# EAGLE design BME280-Breakout_v10 (EAGLE 7.5.0)
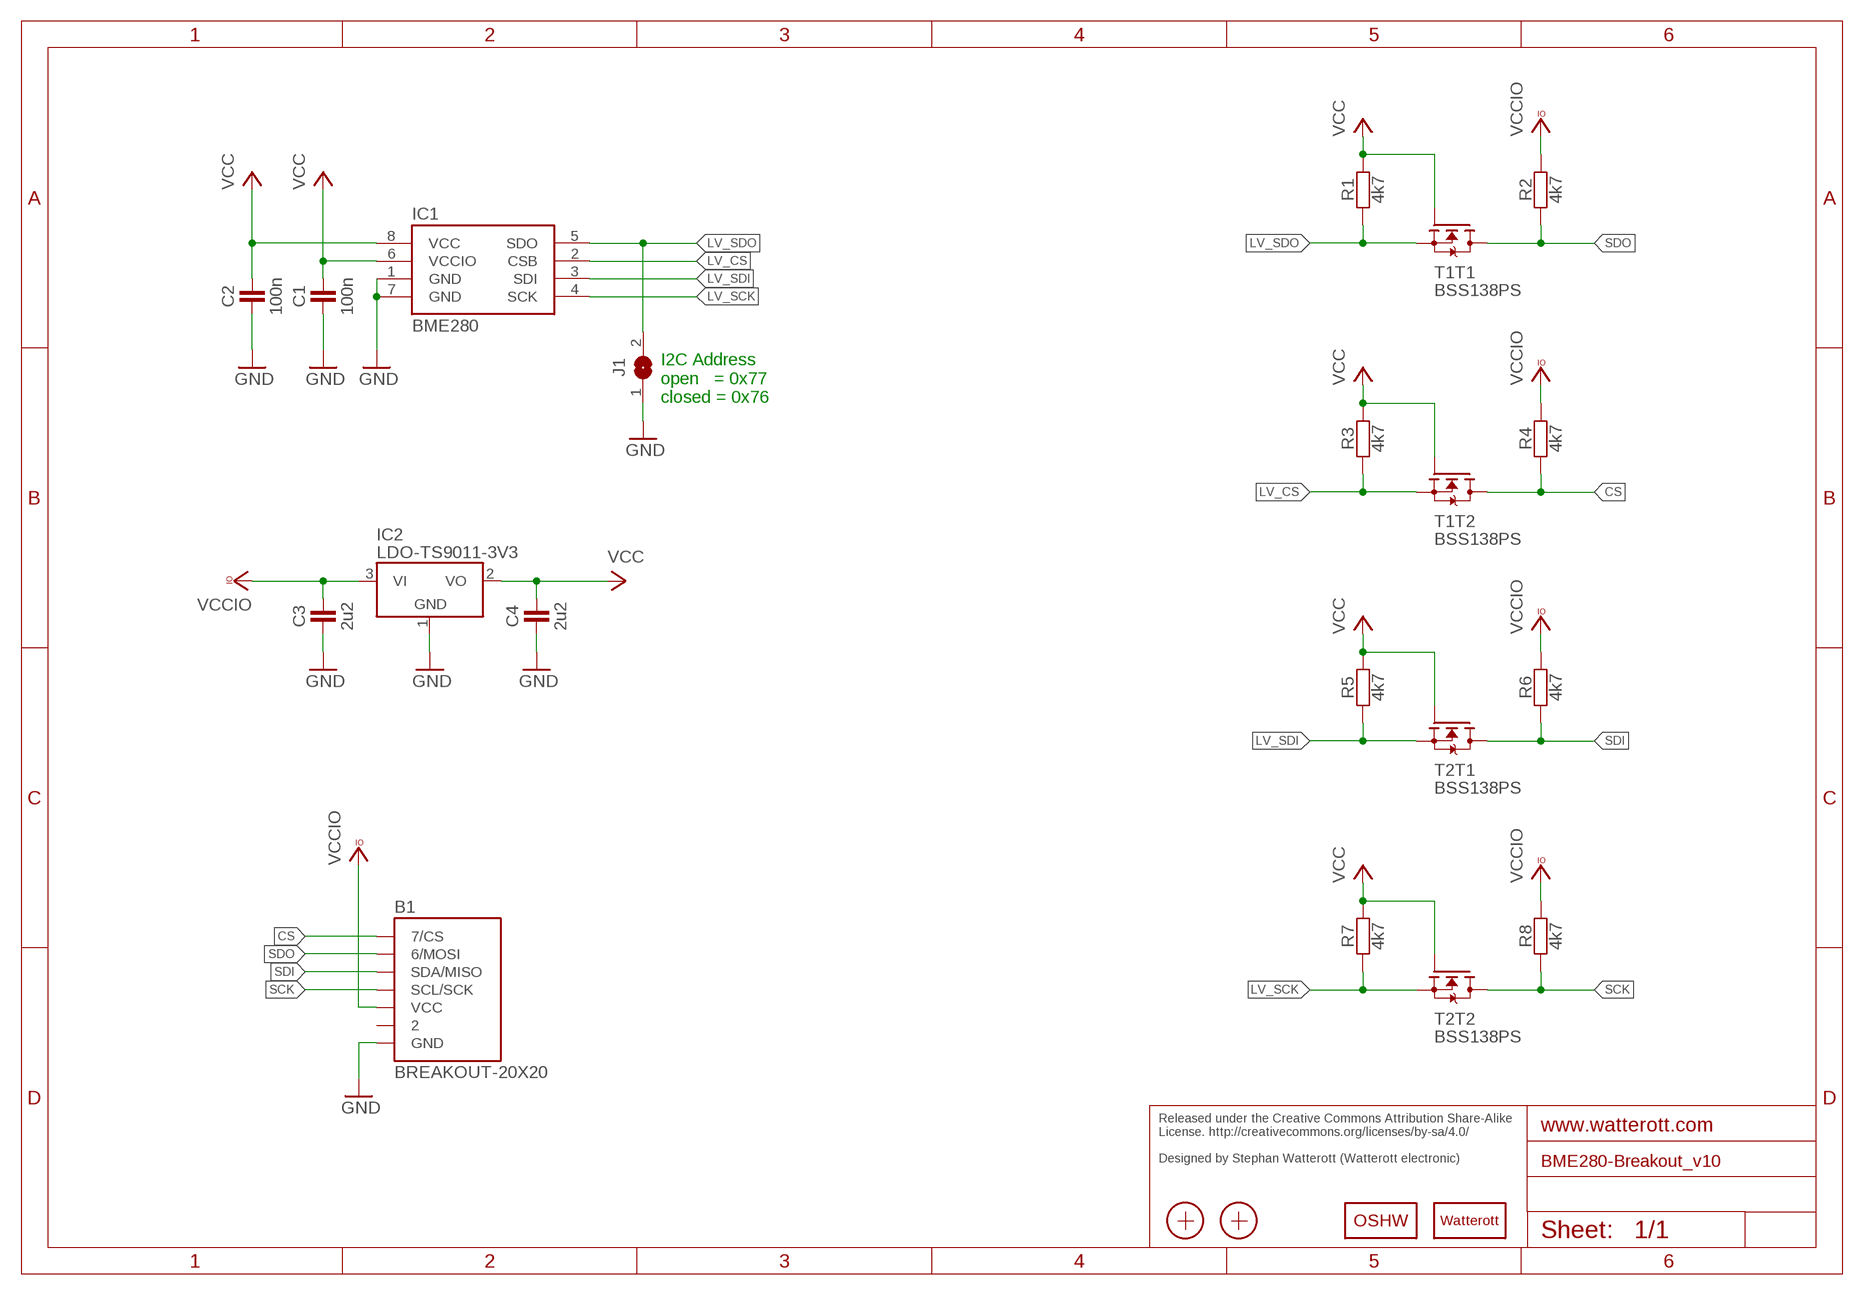
[diagram p0: schematic, sheet 1]

## Parts
B1  BREAKOUT-20X20  [BREAKOUT-20X20]
C1  100n  CAPACITOR-0402  [C0402]
C2  100n  CAPACITOR-0402  [C0402]
C3  2u2  CAPACITOR-0402  [C0402]
C4  2u2  CAPACITOR-0402  [C0402]
IC1  BME280  [CAVITY_MEMS]
IC2  LDO-TS9011-3V3  [SOT23]
J1  JUMPER2-0603  [JUMPER2-0603]
LOGO1  LOGO-S_PLACE_S  [SPARK_TPLACE_S]
LOGO2  OSHW_LOGOX0070  [OSHW_6X70]
R1  4k7  RESISTOR-0402  [C0402]
R2  4k7  RESISTOR-0402  [C0402]
R3  4k7  RESISTOR-0402  [C0402]
R4  4k7  RESISTOR-0402  [C0402]
R5  4k7  RESISTOR-0402  [C0402]
R6  4k7  RESISTOR-0402  [C0402]
R7  4k7  RESISTOR-0402  [C0402]
R8  4k7  RESISTOR-0402  [C0402]
T1  BSS138PS  [SOT363]
T2  BSS138PS  [SOT363]
X1  PASSER-07  [PASSER_07MM]
X2  PASSER-07  [PASSER_07MM]

## Nets
CS: B1.CS(7/CS) R4.1 T1.3(T2:D)
GND: B1.GND C1.1 C2.1 C3.1 C4.1 IC1.1(GND) IC1.7(GND) IC2.1(GND) J1.1
LV_CS: IC1.2(CSB) R3.1 T1.4(T2:S)
LV_SCK: IC1.4(SCK) R7.1 T2.4(T2:S)
LV_SDI: IC1.3(SDI) R5.1 T2.1(T1:S)
LV_SDO: IC1.5(SDO) J1.2 R1.1 T1.1(T1:S)
SCK: B1.SCL/SCK R8.1 T2.3(T2:D)
SDI: B1.SDA/MISO R6.1 T2.6(T1:D)
SDO: B1.MOSI(6/MOSI) R2.1 T1.6(T1:D)
VCC: C1.2 C2.2 C4.2 IC1.6(VCCIO) IC1.8(VCC) IC2.2(VO) R1.2 R3.2 R5.2 R7.2 T1.2(T1:G) T1.5(T2:G) T2.2(T1:G) T2.5(T2:G)
VCCIO: B1.VCC C3.2 IC2.3(VI) R2.2 R4.2 R6.2 R8.2
Unconnected: B1.2

## Notes on the sheet
- I2C Address
  open   = 0x77
  closed = 0x76
- Released under the Creative Commons Attribution Share-Alike 
  License. http://creativecommons.org/licenses/by-sa/4.0/
  
  Designed by Stephan Watterott (Watterott electronic)

## Library data of the parts
B1 = we-board:BREAKOUT: Breakout Template
C1-C4 = we-rcl:CAPACITOR: Capacitors ...4.7uF @ 6.3V -> 0402 ...10uF @ 16V -> 0603 ...22uF @ 25V -> 0805
IC1 = we-sensor:BME280: Bosch BME280 Humidity and Pressure Sensor
IC2 = we-power:LDO: LDOs TS1117 800mA, Vin max 12V - compatible NCP1117 1A, Vin max 20V TS9011 250mA, Vin max 12V - compatible AP2210 300mA, Vin max 15V TS5204 150mA, Vin max 16V
J1 = we-rcl:JUMPER2: 2 Pin Jumpers
LOGO1 = we-symbol:LOGO: Watterott electronic Logo
LOGO2 = we-symbol:OSHW_LOGO: Open-Source-Hardware Logo
R1-R8 = we-rcl:RESISTOR: Resistors all kinds in 0603 and 0402
T1 T2 = we-transistor:BSS138PS: BSS138 Dual N-Channel MOSFET (UGS +/-20V, RDS 1Ohm, ID 320mA)
X1 X2 = we-symbol:PASSER: Fiducial Markers

## Board
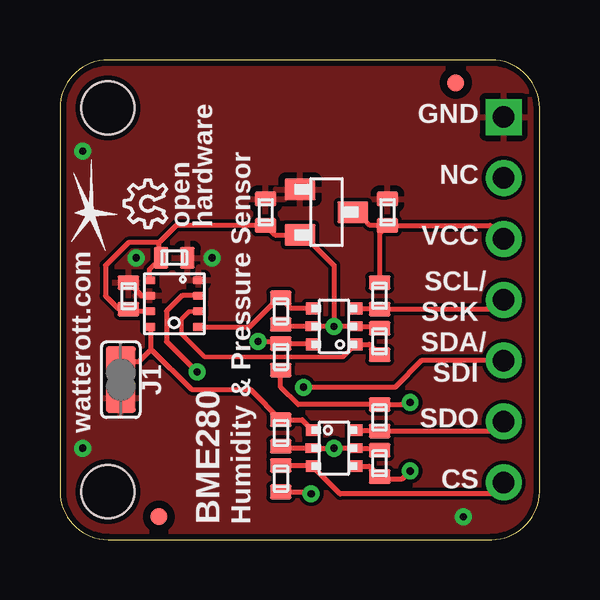
[diagram p1: board, top side]
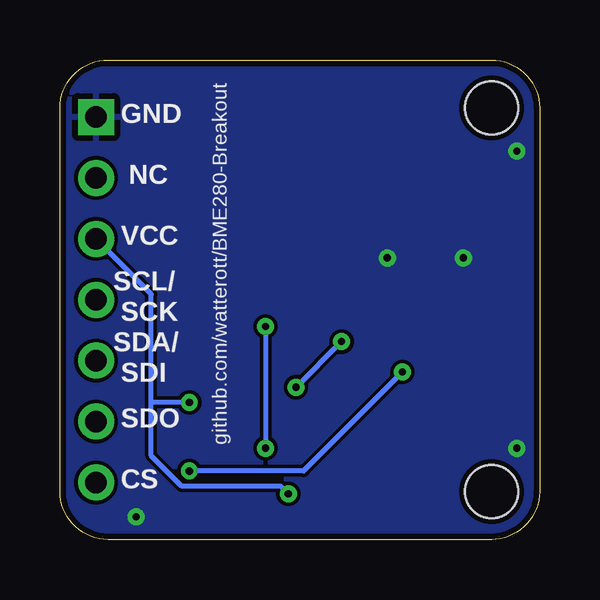
[diagram p2: board, bottom side, seen from below]

Size 20 x 20 mm. Coordinates in mm from the lower left corner, seen from the top.
Copper layers (1*16): Top 0.035mm / dielectric 1.5mm / Bottom 0.035mm
Design rules "default *": minimum track width 7mil, minimum drill 24mil, track to track 6mil, track to pad 6mil, pad to pad 6mil, via to via 6mil, smd to smd 6mil, copper to edge 10mil, drill to drill 8mil, minimum pad ring 10mil, minimum via ring 8mil, stop-mask expansion 4mil, vias tented up to drill 12mil, thermal gap 10mil

### Footprints (pad centres in the part's own frame; a part is rotated, then mirrored left to right if it is on the bottom)
BREAKOUT-20X20 = drill 0.9 pad 1.5: 2 18.5,15.08; CS 18.5,2.38; MOSI 18.5,4.92; SCL/SCK 18.5,10; SDA/MISO 18.5,7.46; VCC 18.5,12.54 | drill 0.9 pad 1.5 square: GND 18.5,17.62 | hole 2.2: 2,18; 2,2
C0402 = smd 0.9 x 0.6: 1 0,0.55; 2 0,-0.55
CAVITY_MEMS = smd 0.5 x 0.35: 1 1.025,0.975; 2 1.025,0.325; 3 1.025,-0.325; 4 1.025,-0.975; 5 -1.025,-0.975; 6 -1.025,-0.325; 7 -1.025,0.325; 8 -1.025,0.975
SOT23 = smd 1.3 x 0.9: 1 -1.1,0.95; 2 -1.1,-0.95; 3 1.1,0
JUMPER2-0603 = smd 1.25 x 1.25: 1 0,0.76; 2 0,-0.76
SOT363 = smd 0.6 x 0.5: 1 -0.9,0.75; 3 -0.9,-0.75; 4 0.9,-0.75; 6 0.9,0.75 | smd 0.6 x 0.4: 2 -0.9,0; 5 0.9,0
PASSER_07MM = smd 0.7 x 0.7: X 0,0

### Placement (x,y rotation side)
B1  0,0 0 top
C1  4.76,11.75 270 top
C2  2.86,10.16 0 top
C3  13.65,13.65 0 top
C4  8.57,13.65 0 top
IC1  4.76,9.84 0 top
IC2  11.11,13.65 0 top
J1  2.54,6.67 180 top
LOGO1  1.27,13.65 90 top
LOGO2  4.45,13.02 90 top
R1  9.21,4.45 0 top
R2  13.34,5.08 180 top
R3  13.34,3.17 180 top
R4  9.21,2.54 0 top
R5  13.34,8.26 180 top
R6  9.21,7.62 0 top
R7  9.21,9.53 0 top
R8  13.34,10.16 180 top
T1  11.43,3.81 0 top
T2  11.43,8.89 180 top
X1  16.51,19.05 0 top
X2  4.13,0.95 0 top

### Tracks (layer width: path | path; a pad name or v marks a point on that pad's centre or on a via)
CS
  Top 0.2: R4.1 10.5,3.09 T1.3 11.69,1.91 18.1,1.91 18.5,2.31 B1.CS
GND  (via drill 0.3)
  Top 0.2: IC1.7 3.4,10.17 C2.1
  other vias: 6.35,11.75 3.17,11.75 0.95,3.81 0.95,16.19 16.83,0.95
  pour Bottom: 0,0 0,20 20,20 20,0
  pour Top: 0,0 0,20 20,20 20,0
LV_CS  (via drill 0.3)
  Top 0.2: T1.4 12.9,3.06 R3.1 13.42,2.54 14.29,2.54 v14.61,2.86 | IC1.2 5.09,10.17 4.45,9.53 4.45,8.26 v5.71,6.99
  Bottom 0.2: v5.71,6.99 9.84,2.86 v14.61,2.86
LV_SCK
  Top 0.2: T2.4 9.64,9.64 R7.1 9.12,10.16 9.21,10.16 7.92,8.87 IC1.4
LV_SDI
  Top 0.178: IC1.3 5.39,9.52 5.08,9.21 5.08,8.57 6.03,7.62 11.81,7.62 T2.1
  Top 0.2: T2.1 12.9,8.14 R5.1
LV_SDO
  Top 0.2: T1.1 10.1,5 R1.1 7.94,6.26 5.48,6.26 3.81,7.94 | 3.81,7.94 3.81,8.79 IC1.5 | J1.2 3.3,7.43 3.81,7.94
SCK
  Top 0.2: T2.3 13.3,9.64 R8.1 18.11,9.61 B1.SCL/SCK
SDI  (via drill 0.3)
  Top 0.2: B1.SDA/MISO 15.08,7.46 13.97,6.35 v10.16,6.35 | T2.6 10.5,8.17 R6.1 9.12,8.26 v8.26,8.26
  Bottom 0.2: v10.16,6.35 v8.26,8.26
SDO
  Top 0.2: T1.6 13.3,4.56 R2.1 18.11,4.53 B1.MOSI
VCC  (via drill 0.3)
  Top 0.2: R5.2 13.25,8.89 T2.2 v11.43,8.89 | v11.43,8.89 T2.5 9.29,8.89 R7.2 | R3.2 13.25,3.81 T1.5 v11.43,3.81 T1.2 9.29,3.81 R1.2 | IC1.6 2.95,9.52 C2.2 2.46,9.61 1.91,10.16 1.91,11.43 2.86,12.38 4.13,12.38 | IC1.8 3.74,11.27 C1.2 4.13,11.83 4.13,12.38 | 4.13,12.38 4.85,13.1 C4.2 8.97,12.7 IC2.2 10.16,12.7 11.43,11.43 v11.43,8.89
  Bottom 0.2: v11.43,8.89 v11.43,3.81
VCCIO  (via drill 0.3)
  Top 0.2: C3.2 12.93,13.1 12.7,13.34 12.53,13.34 IC2.3 | R8.2 13.34,12.79 C3.2 | R6.2 9.21,6.35 9.93,5.63 R2.2 14.52,5.63 v14.61,5.71 | C3.2 17.94,13.1 B1.VCC | R4.2 10.39,1.99 v10.48,1.91
  Bottom 0.2: v10.48,1.91 10.79,2.22 14.92,2.22 16.19,3.49 16.19,5.71 | 16.19,5.71 16.19,10.23 B1.VCC | v14.61,5.71 16.19,5.71

### Text on the board
tPlace: GND | NC | open | hardware | VCC | SCL/ | SCK | SDA/ | SDI | SDO | watterott.com | CS | BME280 | Humidity & Pressure Sensor
bPlace: github.com/watterott/BME280-Breakout | GND | NC | VCC | SCL/ | SCK | SDA/ | SDI | SDO | CS